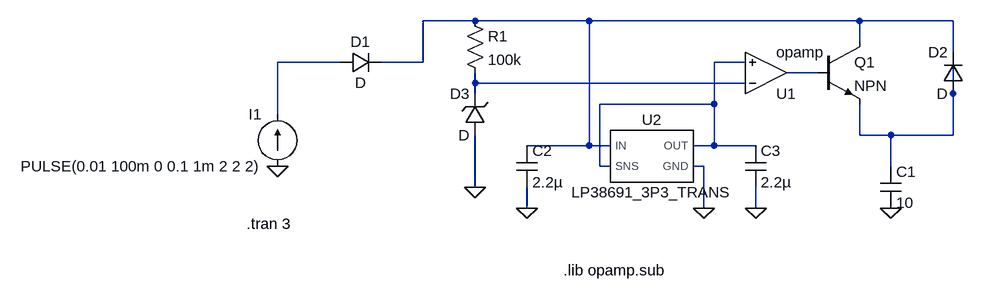
[diagram p0: schematic sim1.asc]
sim1.asc, the LTspice schematic file:
Version 4
SHEET 1 880 680
WIRE -96 -16 -176 -16
WIRE 80 -16 -96 -16
WIRE 496 -16 80 -16
WIRE 640 -16 496 -16
WIRE 496 16 496 -16
WIRE 640 32 640 -16
WIRE -304 48 -400 48
WIRE -176 48 -176 -16
WIRE -176 48 -240 48
WIRE 320 48 272 48
WIRE 432 64 384 64
WIRE -96 80 -96 64
WIRE 320 80 -96 80
WIRE -96 96 -96 80
WIRE 640 96 640 48
WIRE 272 112 272 48
WIRE 272 112 96 112
WIRE -400 128 -400 48
WIRE 496 160 496 112
WIRE 544 160 496 160
WIRE 640 160 640 96
WIRE 640 160 544 160
WIRE 80 176 80 -16
WIRE 80 176 -16 176
WIRE 112 176 80 176
WIRE 272 176 272 112
WIRE 272 176 240 176
WIRE 336 176 272 176
WIRE 96 208 96 112
WIRE 112 208 96 208
WIRE 256 208 240 208
WIRE 544 208 544 160
WIRE -96 240 -96 160
WIRE -16 272 -16 240
WIRE 256 272 256 208
WIRE 336 272 336 240
FLAG -400 208 0
FLAG 544 272 0
FLAG -96 240 0
FLAG -16 272 0
FLAG 336 272 0
FLAG 256 272 0
SYMBOL current -400 208 R180
WINDOW 0 24 80 Left 2
WINDOW 3 24 0 Left 2
WINDOW 123 0 0 Left 2
WINDOW 39 0 0 Left 2
SYMATTR InstName I1
SYMATTR Value PULSE(0.01 100m 0 0.1 1m 2 2 2)
SYMBOL diode -304 64 R270
WINDOW 0 32 32 VTop 2
WINDOW 3 0 32 VBottom 2
SYMATTR InstName D1
SYMBOL diode 656 96 R180
WINDOW 0 24 64 Left 2
WINDOW 3 24 0 Left 2
SYMATTR InstName D2
SYMBOL cap 528 208 R0
SYMATTR InstName C1
SYMATTR Value 10
SYMBOL npn 432 16 R0
SYMATTR InstName Q1
SYMBOL Opamps\\opamp 352 128 M180
SYMATTR InstName U1
SYMBOL zener -80 160 R180
WINDOW 0 24 64 Left 2
WINDOW 3 24 0 Left 2
SYMATTR InstName D3
SYMBOL res -112 -32 R0
SYMATTR InstName R1
SYMATTR Value 100k
SYMBOL cap -32 176 R0
SYMATTR InstName C2
SYMATTR Value 2.2µ
SYMBOL cap 320 176 R0
SYMATTR InstName C3
SYMATTR Value 2.2µ
SYMBOL LP38691_3P3_TRANS 176 192 R0
SYMATTR InstName U2
TEXT -448 296 Left 2 !.tran 3
TEXT 40 368 Left 2 !.lib opamp.sub

The netlist it stands for:
* sim1.asc
I1 0 N002 PULSE(0.01 100m 0 0.1 1m 2 2 2)
D1 N002 N001 D
D2 N006 N001 D
C1 N006 0 10
Q1 N001 N004 N006 0 NPN
XU1 N005 N003 N004 opamp Aol=100K GBW=10Meg  ; pins invin noninvin out
D3 0 N005 D
R1 N001 N005 100k
C2 N001 0 2.2µ
C3 N003 0 2.2µ
XU2 N001 N003 N003 0 LP38691_3P3_TRANS  ; pins IN SNS OUT GND
.model D D
.lib standard.dio
.model NPN NPN
.model PNP PNP
.lib standard.bjt
.tran 3
.lib opamp.sub
.lib Z:\home\winson\CanSat\UCSD-Cansat-2016-17\hardware\power\lib\lp38691_3p3_trans.lib
.backanno
.end